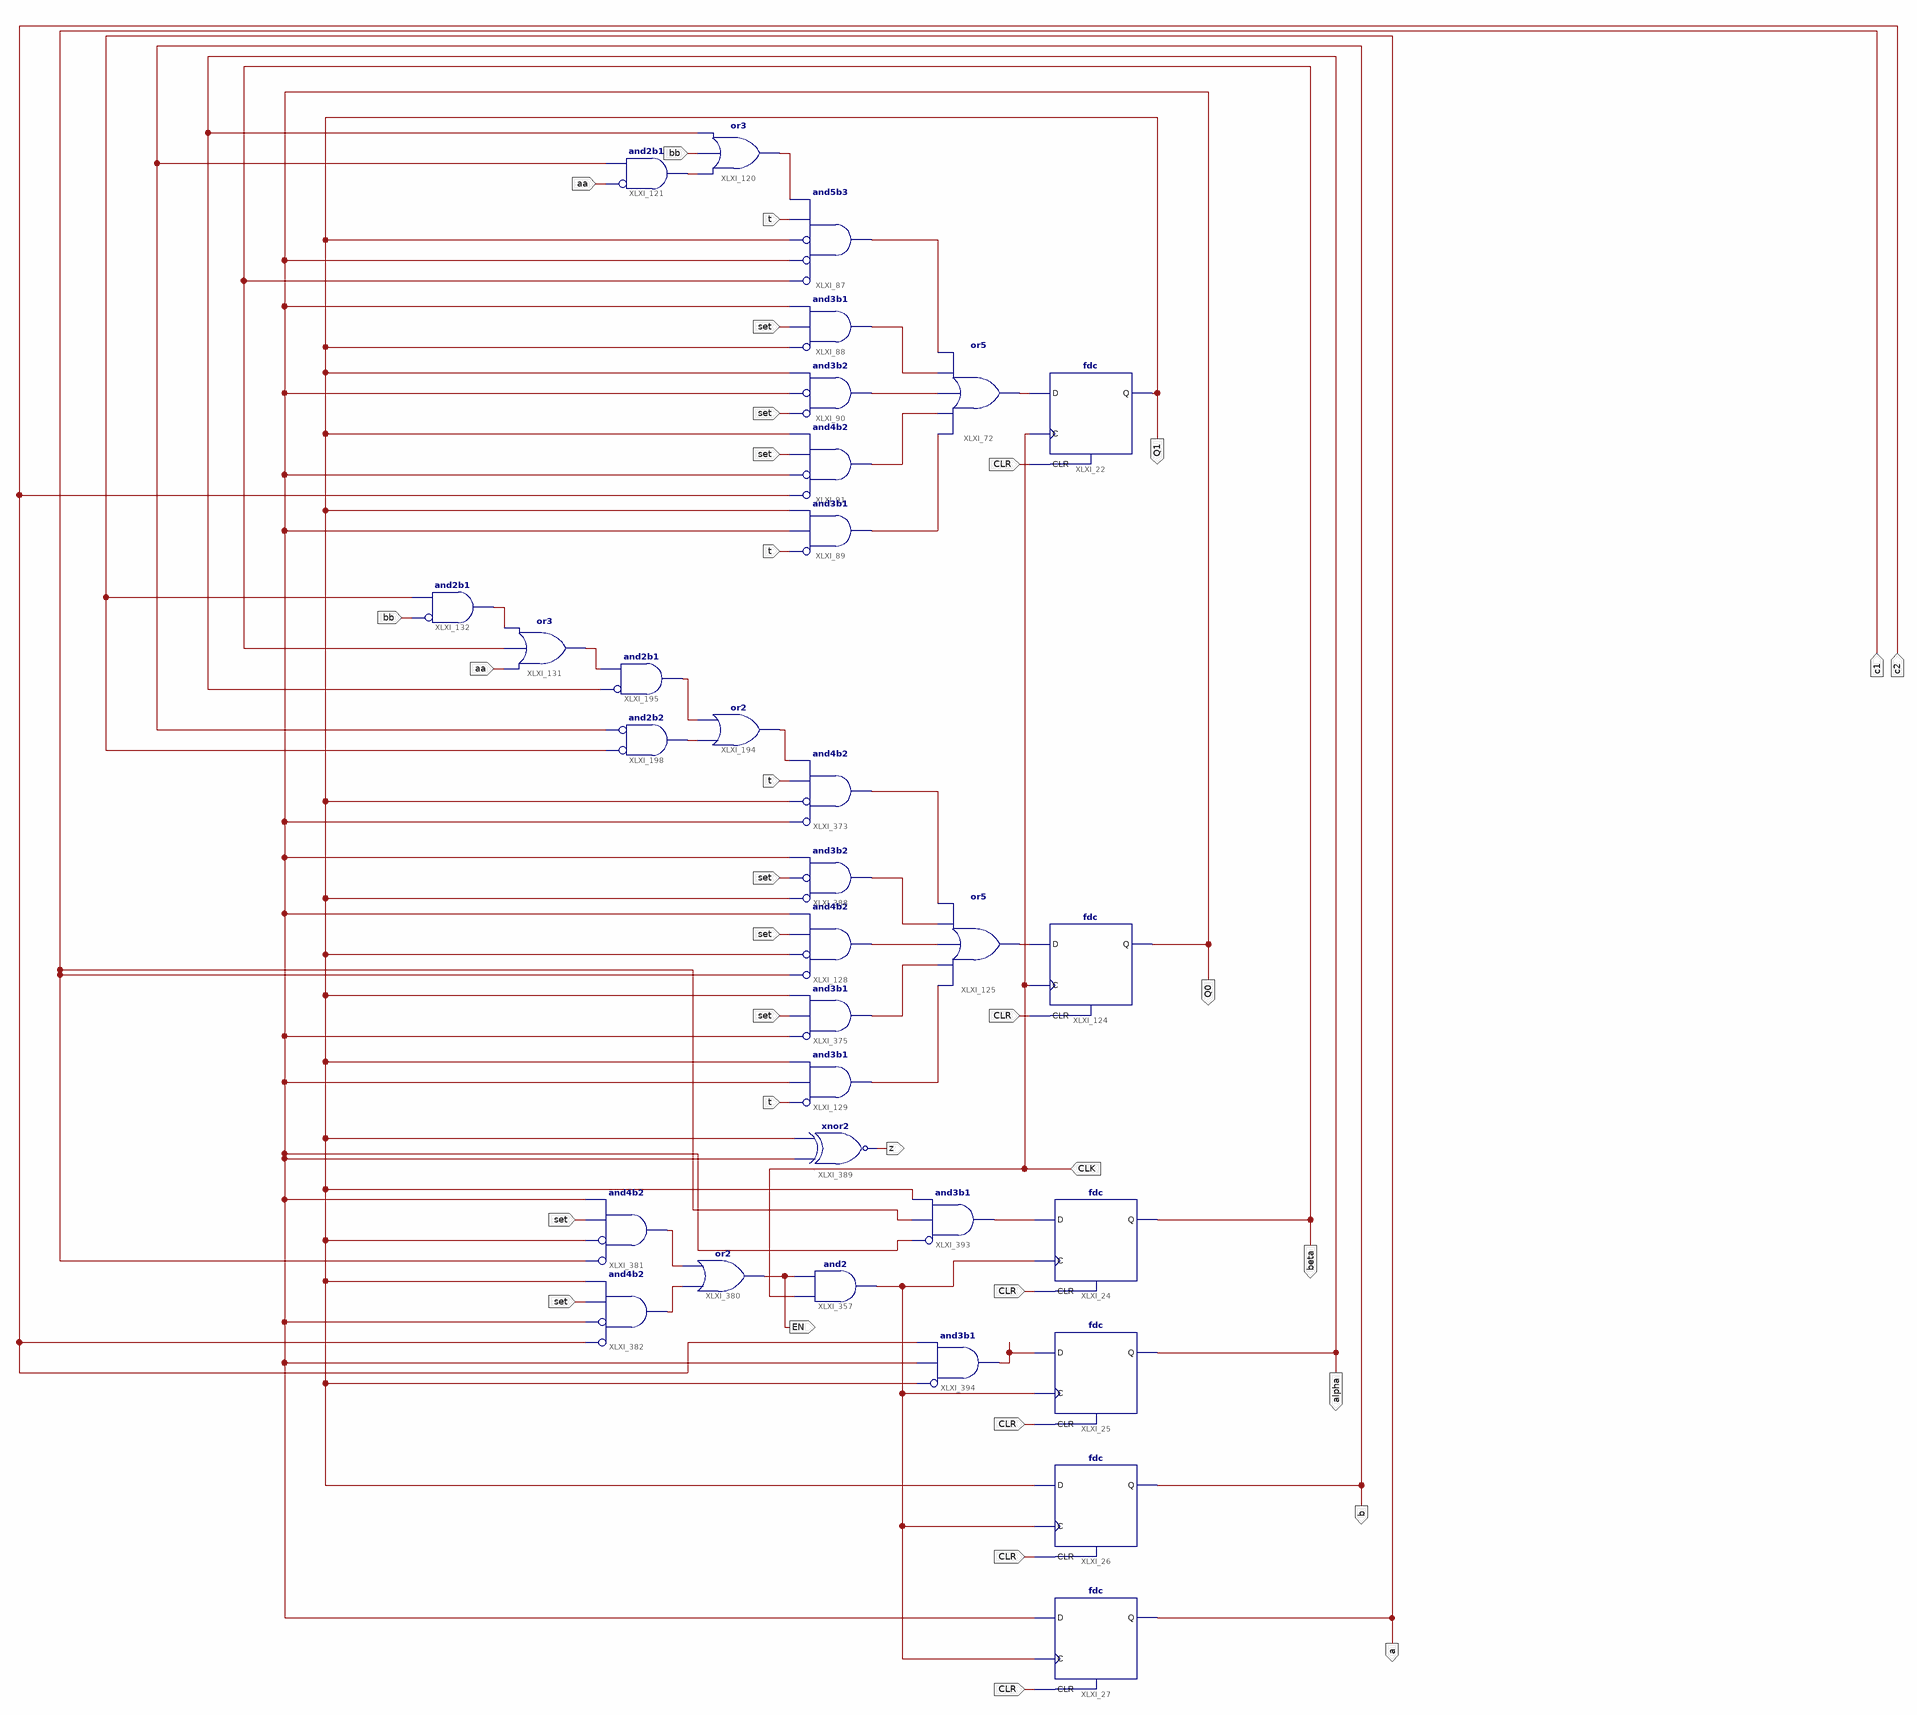
[diagram p0: schematic sheet 1]
// Xilinx ISE schematic Updown_top.sch (spartan3) as structural Verilog: 32 symbols, 16 ports
module Updown_top (
  input  c1,
  input  c2,
  input  CLK,
  input  CLR,
  input  bb,
  input  aa,
  input  t,
  input  set,
  output beta,
  output alpha,
  output b,
  output a,
  output Q1,
  output Q0,
  output z,
  output EN
);

  wire XLXN_1, XLXN_10, XLXN_11, XLXN_12, XLXN_13, XLXN_14, XLXN_15, XLXN_16, XLXN_19, XLXN_20, XLXN_21,
       XLXN_22, XLXN_23, XLXN_24, XLXN_76, XLXN_86, XLXN_97, XLXN_102, XLXN_103, XLXN_265, XLXN_266,
       XLXN_268, XLXN_269, XLXN_345;

  fdc XLXI_22 (.C(CLK), .CLR(CLR), .D(XLXN_1), .Q(Q1));
  or XLXI_72 (XLXN_1, XLXN_12, XLXN_11, XLXN_10, XLXN_13, XLXN_14);
  and XLXI_88 (XLXN_13, ~Q1, set, Q0);  // and3b1
  and XLXI_90 (XLXN_10, ~set, ~Q0, Q1);  // and3b2
  and XLXI_91 (XLXN_11, ~c2, ~Q0, set, Q1);  // and4b2
  and XLXI_89 (XLXN_12, ~t, Q0, Q1);  // and3b1
  and XLXI_87 (XLXN_14, ~beta, ~Q0, ~Q1, t, XLXN_15);  // and5b3
  or XLXI_120 (XLXN_15, XLXN_16, bb, alpha);
  and XLXI_121 (XLXN_16, ~aa, b);  // and2b1
  fdc XLXI_124 (.C(CLK), .CLR(CLR), .D(XLXN_19), .Q(Q0));
  or XLXI_125 (XLXN_19, XLXN_22, XLXN_21, XLXN_20, XLXN_23, XLXN_24);
  and XLXI_129 (XLXN_22, ~t, Q0, Q1);  // and3b1
  and XLXI_195 (XLXN_102, ~alpha, XLXN_86);  // and2b1
  and XLXI_198 (XLXN_97, ~a, ~b);  // and2b2
  or XLXI_194 (XLXN_76, XLXN_97, XLXN_102);
  or XLXI_131 (XLXN_86, aa, beta, XLXN_103);
  and XLXI_132 (XLXN_103, ~bb, a);  // and2b1
  and XLXI_357 (XLXN_266, CLK, EN);
  fdc XLXI_24 (.C(XLXN_266), .CLR(CLR), .D(XLXN_345), .Q(beta));
  fdc XLXI_25 (.C(XLXN_266), .CLR(CLR), .D(XLXN_265), .Q(alpha));
  fdc XLXI_26 (.C(XLXN_266), .CLR(CLR), .D(Q1), .Q(b));
  fdc XLXI_27 (.C(XLXN_266), .CLR(CLR), .D(Q0), .Q(a));
  and XLXI_373 (XLXN_24, ~Q0, ~Q1, t, XLXN_76);  // and4b2
  and XLXI_128 (XLXN_20, ~c1, ~Q1, set, Q0);  // and4b2
  and XLXI_375 (XLXN_21, ~Q0, set, Q1);  // and3b1
  or XLXI_380 (EN, XLXN_269, XLXN_268);
  and XLXI_381 (XLXN_268, ~c1, ~Q1, set, Q0);  // and4b2
  and XLXI_382 (XLXN_269, ~c2, ~Q0, set, Q1);  // and4b2
  and XLXI_388 (XLXN_23, ~Q1, ~set, Q0);  // and3b2
  xnor XLXI_389 (z, Q0, Q1);
  and XLXI_393 (XLXN_345, ~Q0, c1, Q1);  // and3b1
  and XLXI_394 (XLXN_265, ~Q1, Q0, c2);  // and3b1
endmodule
